# Altium project NNLightSwitcher.PrjPcb (part 1 of 5)
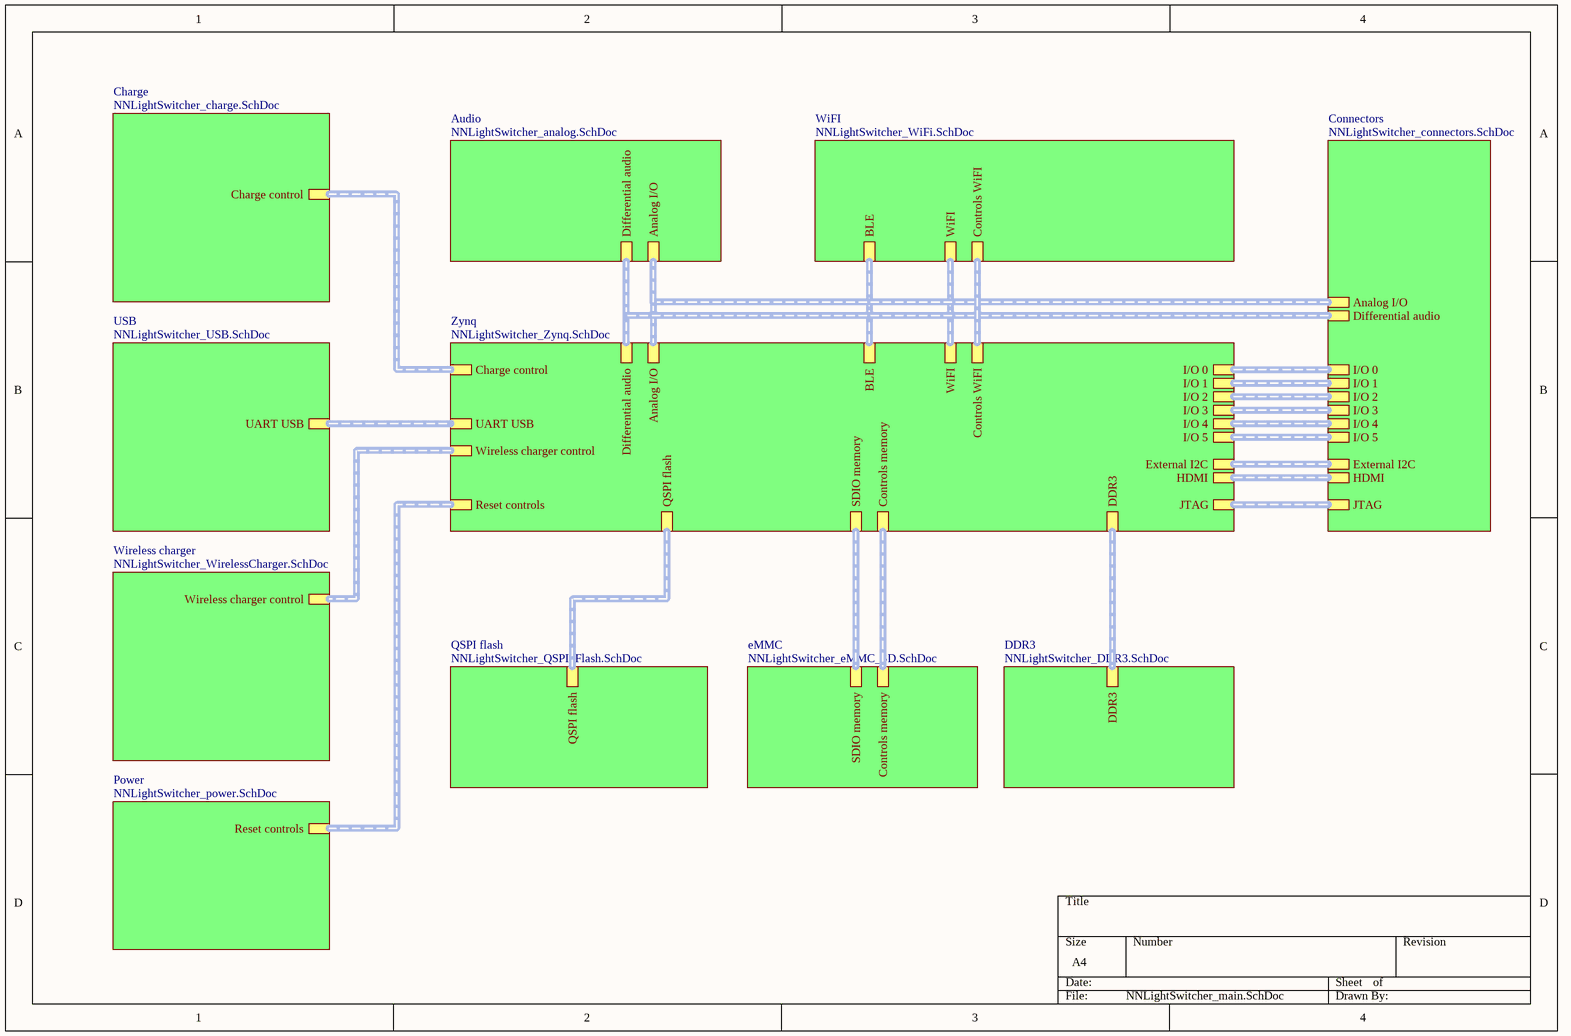
[diagram p0: NNLightSwitcher_main.SchDoc]
12 sheets, 369 parts. Net scope: hierarchical (ports join the sheet entries above them; power ports are global).
Board file: NNLightSwitcher.PcbDoc
Sheets:
  NNLightSwitcher_main.SchDoc
    Zynq = NNLightSwitcher_Zynq.SchDoc
    DDR3 = NNLightSwitcher_DDR3.SchDoc
    eMMC = NNLightSwitcher_eMMC_SD.SchDoc
    QSPI flash = NNLightSwitcher_QSPI_Flash.SchDoc
    WiFI = NNLightSwitcher_WiFi.SchDoc
    USB = NNLightSwitcher_USB.SchDoc
    Power = NNLightSwitcher_power.SchDoc
    Audio = NNLightSwitcher_analog.SchDoc
    Connectors = NNLightSwitcher_connectors.SchDoc
    Wireless charger = NNLightSwitcher_WirelessCharger.SchDoc
    Charge = NNLightSwitcher_charge.SchDoc

## Sheet NNLightSwitcher_main.SchDoc
size A4

### Sub-sheets
Audio = NNLightSwitcher_analog.SchDoc: Analog I/O (harness GPIO), Differential audio (harness Differential Audio)
Charge = NNLightSwitcher_charge.SchDoc: Charge control (harness I2C)
Connectors = NNLightSwitcher_connectors.SchDoc: I/O 0 (harness GPIO), HDMI (harness HDMI), JTAG (harness JTAG), I/O 1 (harness GPIO), I/O 2 (harness GPIO), I/O 3 (harness GPIO), I/O 4 (harness GPIO), I/O 5 (harness GPIO), External I2C (harness I2C), Analog I/O (harness GPIO), Differential audio (harness Differential Audio)
DDR3 = NNLightSwitcher_DDR3.SchDoc: DDR3 (harness DDR3)
eMMC = NNLightSwitcher_eMMC_SD.SchDoc: SDIO memory (harness SDIO), Controls memory (harness Controls flash)
Power = NNLightSwitcher_power.SchDoc: Reset controls (harness Controls reset)
QSPI flash = NNLightSwitcher_QSPI_Flash.SchDoc: QSPI flash (harness QuadSPI)
USB = NNLightSwitcher_USB.SchDoc: UART USB (harness UART)
WiFI = NNLightSwitcher_WiFi.SchDoc: BLE (harness UART), WiFI (harness SDIO), Controls WiFI (harness Controls WiFI)
Wireless charger = NNLightSwitcher_WirelessCharger.SchDoc: Wireless charger control (harness GPIO)
Zynq = NNLightSwitcher_Zynq.SchDoc: Charge control (harness I2C), UART USB (harness UART), BLE (harness UART), WiFI (harness SDIO), DDR3 (harness DDR3), SDIO memory (harness SDIO), QSPI flash (harness QuadSPI), Reset controls (harness Controls reset), I/O 0 (harness GPIO), JTAG (harness JTAG), I/O 2 (harness GPIO), I/O 3 (harness GPIO), I/O 4 (harness GPIO), I/O 1 (harness GPIO), HDMI (harness HDMI), I/O 5 (harness GPIO), Wireless charger control (harness GPIO), External I2C (harness I2C), Analog I/O (harness GPIO), Controls memory (harness Controls flash), Differential audio (harness Differential Audio), Controls WiFI (harness Controls WiFI)

### Buses and harness runs
harness sheet Audio/Analog I/O = sheet Connectors/Analog I/O = sheet Zynq/Analog I/O
harness sheet Audio/Differential audio = sheet Connectors/Differential audio = sheet Zynq/Differential audio
harness sheet Charge/Charge control = sheet Zynq/Charge control
harness sheet Connectors/External I2C = sheet Zynq/External I2C
harness sheet Connectors/HDMI = sheet Zynq/HDMI
harness sheet Connectors/I/O 0 = sheet Zynq/I/O 0
harness sheet Connectors/I/O 1 = sheet Zynq/I/O 1
harness sheet Connectors/I/O 2 = sheet Zynq/I/O 2
harness sheet Connectors/I/O 3 = sheet Zynq/I/O 3
harness sheet Connectors/I/O 4 = sheet Zynq/I/O 4
harness sheet Connectors/I/O 5 = sheet Zynq/I/O 5
harness sheet Connectors/JTAG = sheet Zynq/JTAG
harness sheet DDR3/DDR3 = sheet Zynq/DDR3
harness sheet eMMC/Controls memory = sheet Zynq/Controls memory
harness sheet eMMC/SDIO memory = sheet Zynq/SDIO memory
harness sheet Power/Reset controls = sheet Zynq/Reset controls
harness sheet QSPI flash/QSPI flash = sheet Zynq/QSPI flash
harness sheet USB/UART USB = sheet Zynq/UART USB
harness sheet WiFI/BLE = sheet Zynq/BLE
harness sheet WiFI/Controls WiFI = sheet Zynq/Controls WiFI
harness sheet WiFI/WiFI = sheet Zynq/WiFI
harness sheet Wireless charger/Wireless charger control = sheet Zynq/Wireless charger control

## Sheet NNLightSwitcher_Zynq.SchDoc
size A2
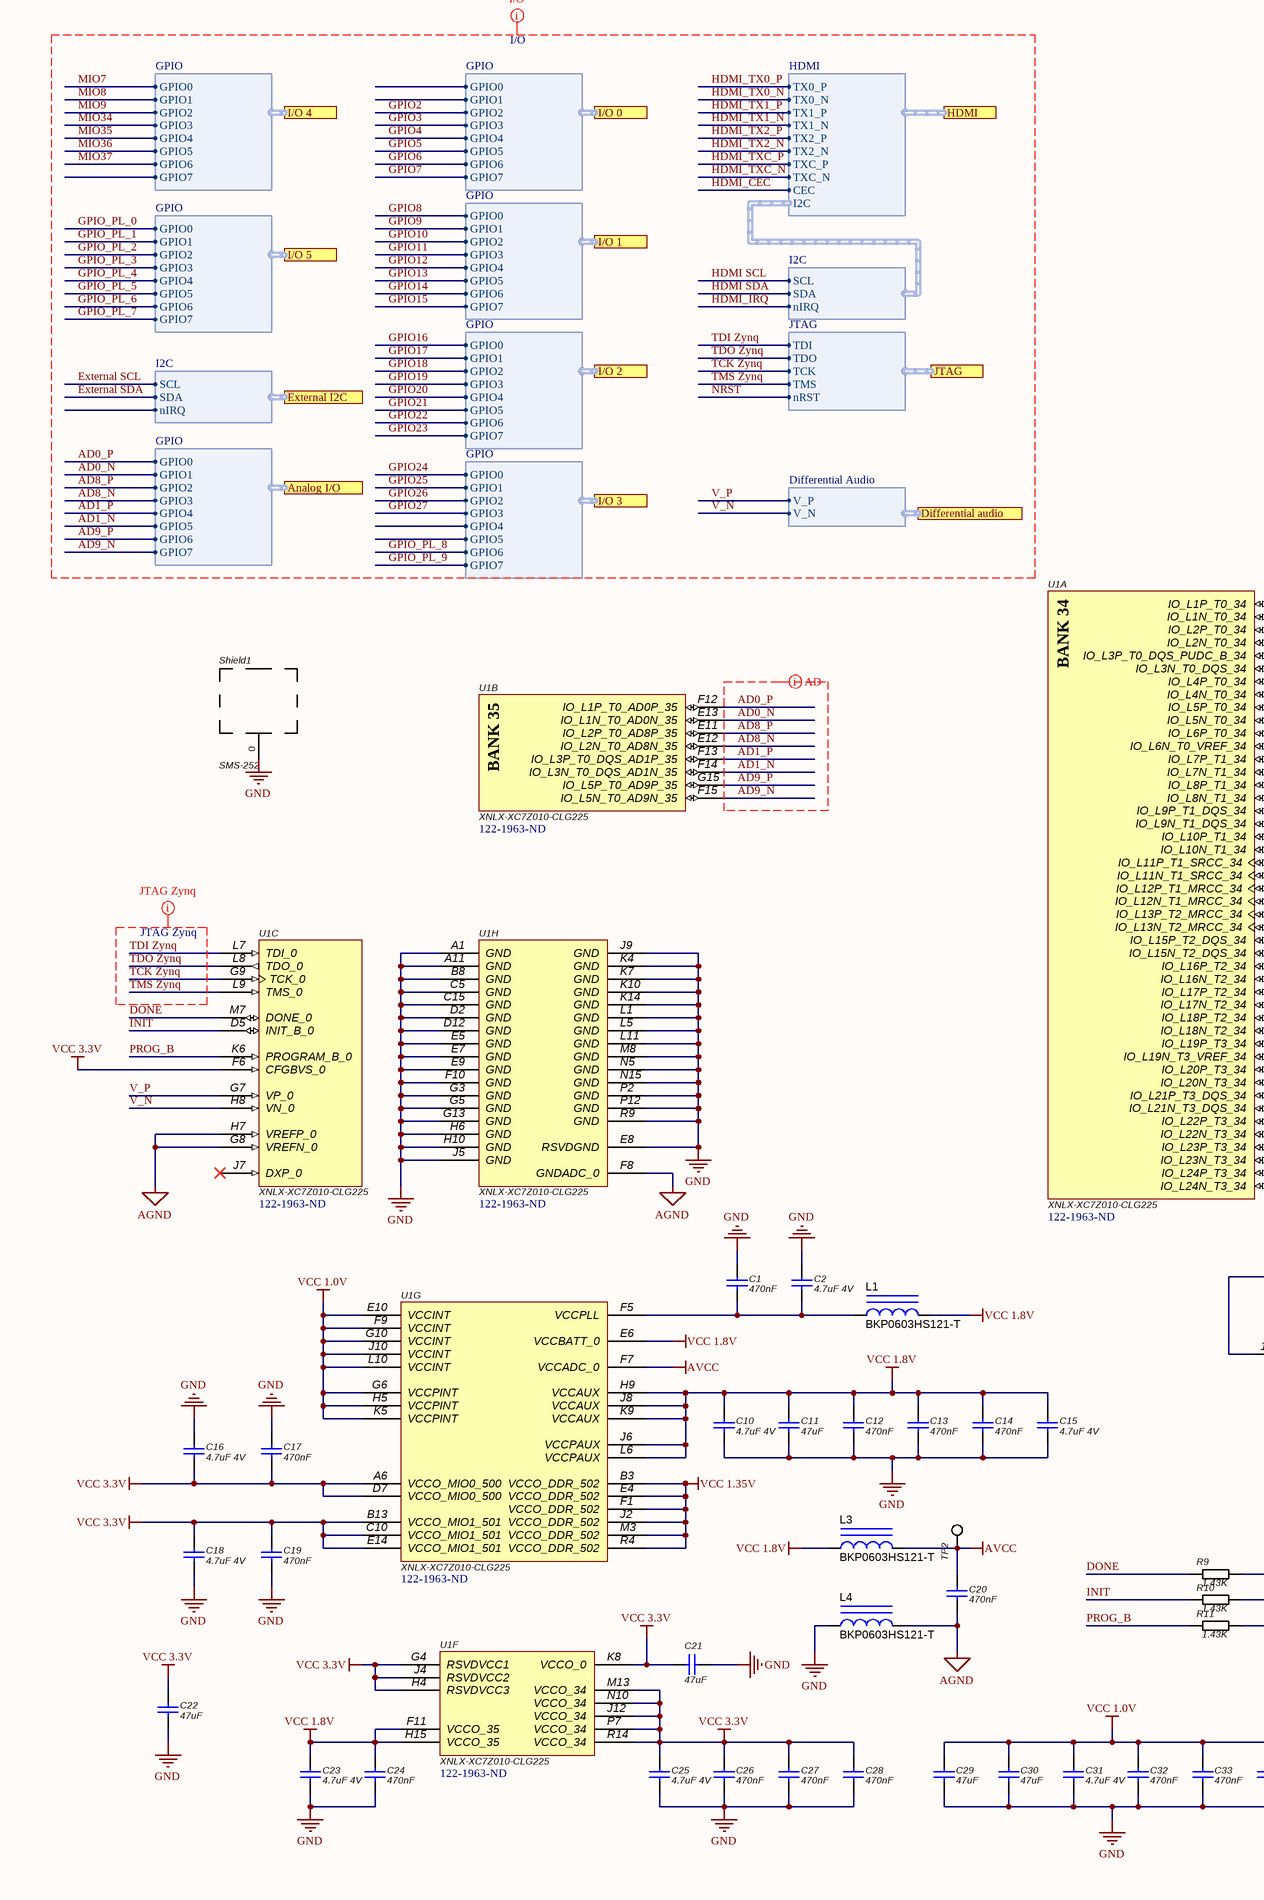
[diagram p1: NNLightSwitcher_Zynq.SchDoc, left]
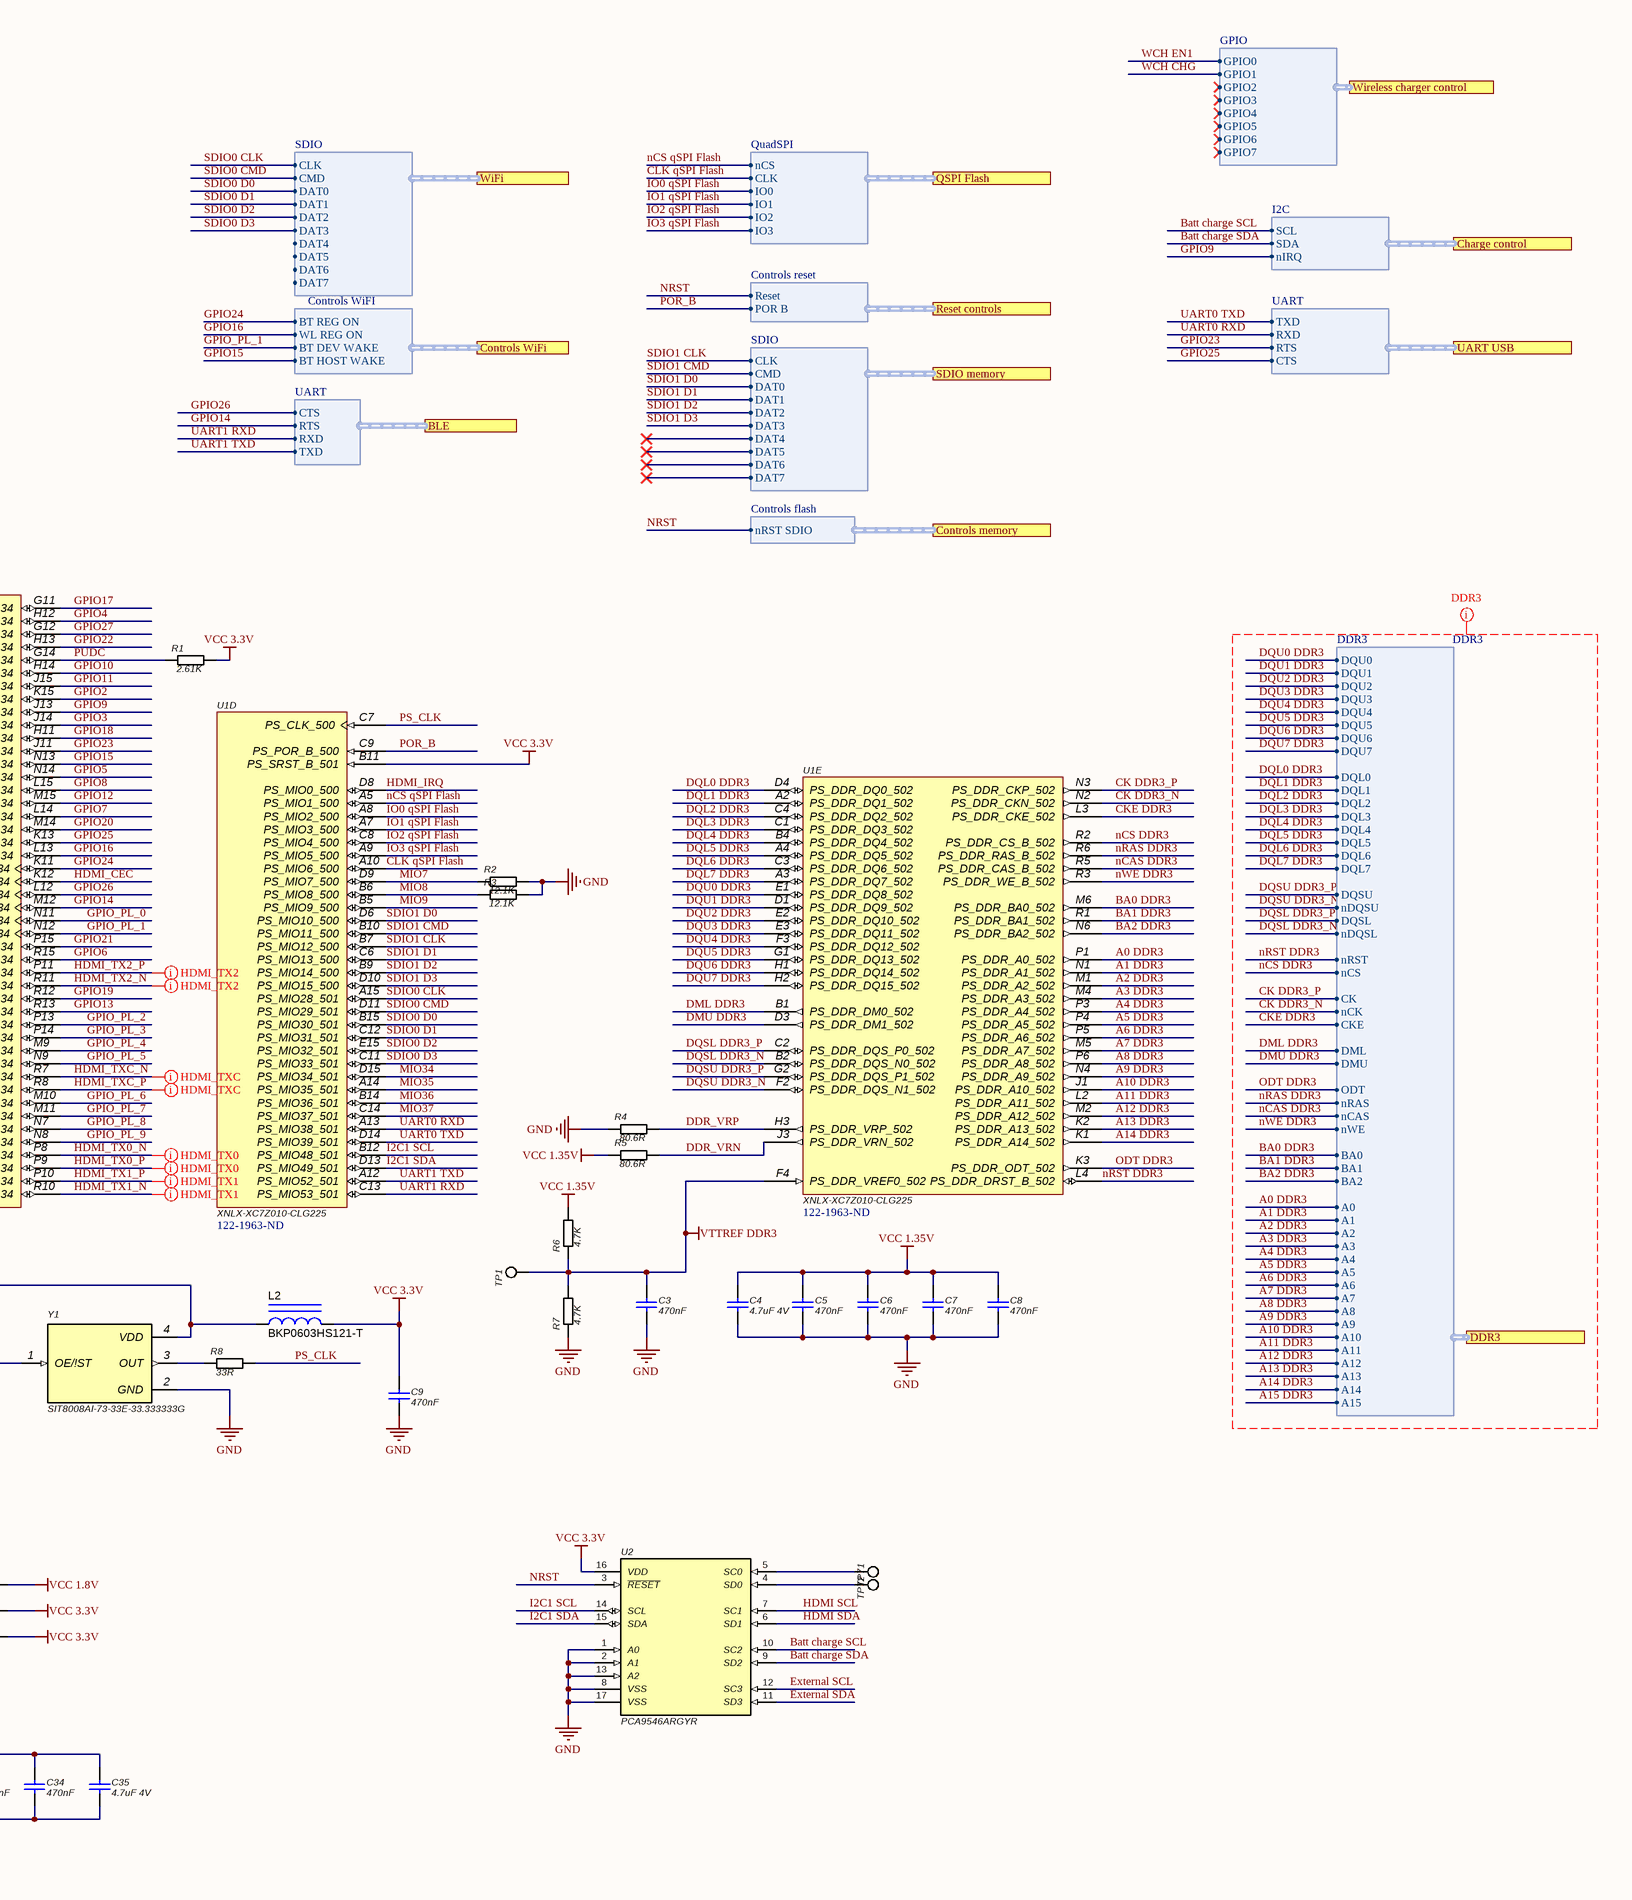
[diagram p2: NNLightSwitcher_Zynq.SchDoc, right]

### Parts
C1  470nF  [0402]
C2  4.7uF 4V  [0402]
C3  470nF  [0402]
C4  4.7uF 4V  [0402]
C5  470nF  [0402]
C6  470nF  [0402]
C7  470nF  [0402]
C8  470nF  [0402]
C9  470nF  [0402]
C10  4.7uF 4V  [0402]
C11  47uF  [Res_0805]
C12  470nF  [0402]
C13  470nF  [0402]
C14  470nF  [0402]
C15  4.7uF 4V  [0402]
C16  4.7uF 4V  [0402]
C17  470nF  [0402]
C18  4.7uF 4V  [0402]
C19  470nF  [0402]
C20  470nF  [0402]
C21  47uF  [Res_0805]
C22  47uF  [Res_0805]
C23  4.7uF 4V  [0402]
C24  470nF  [0402]
C25  4.7uF 4V  [0402]
C26  470nF  [0402]
C27  470nF  [0402]
C28  470nF  [0402]
C29  47uF  [Res_0805]
C30  47uF  [Res_0805]
C31  4.7uF 4V  [0402]
C32  470nF  [0402]
C33  470nF  [0402]
C34  470nF  [0402]
C35  4.7uF 4V  [0402]
L1  BKP0603HS121-T  [*0603]
L2  BKP0603HS121-T  [*0603]
L3  BKP0603HS121-T  [*0603]
L4  BKP0603HS121-T  [*0603]
R1  2.61K  [0402]
R2  12.1K  [0402]
R3  12.1K  [0402]
R4  80.6R  [0402]
R5  80.6R  [0402]
R6  4.7K  [0402]
R7  4.7K  [0402]
R8  33R  [0402]
R9  1.43K  [0402]
R10  1.43K  [0402]
R11  1.43K  [0402]
Shield1  SMS-252  [shield]
TP1  Test point  [Testpoint_Keystone_Miniature]  (value not drawn)
TP2  Test point  [Testpoint_Keystone_Miniature]  (value not drawn)
TP71  Test point  [Testpoint_Keystone_Miniature]  (value not drawn)
TP72  Test point  [Testpoint_Keystone_Miniature]  (value not drawn)
U1  XNLX-XC7Z010-CLG225  Supplier Part Number 1: 122-1963-ND  [CLG225]  (parts A,B,C,D,E,F,G,H of 8)
U2  PCA9546ARGYR  [*QFN50P400X350X100-17N(205X255)]
Y1  SIT8008AI-73-33E-33.333333G  [*OSC_SIT8008AI-73-33E-33.333333G]

### Ports
Analog I/O (harness GPIO), BLE (harness UART), Charge control (harness I2C), Controls memory (harness Controls flash), Controls WiFi (harness Controls WiFI), DDR3 (harness DDR3), Differential audio (harness Differential Audio), External I2C (harness I2C), HDMI (harness HDMI), I/O 0 (harness GPIO), I/O 1 (harness GPIO), I/O 2 (harness GPIO), I/O 3 (harness GPIO), I/O 4 (harness GPIO), I/O 5 (harness GPIO), JTAG (harness JTAG), QSPI Flash (harness QuadSPI), Reset controls (harness Controls reset), SDIO memory (harness SDIO), UART USB (harness UART), WiFi (harness SDIO), Wireless charger control (harness GPIO)

### Harnesses
UART: RXD, RTS, TXD, CTS
QuadSPI: IO1, IO0, IO3, IO2, CLK, nCS
UART: CTS, RTS, RXD, TXD
SDIO: CLK, CMD, DAT1, DAT0, DAT3, DAT2, DAT5, DAT4, DAT7, DAT6
DDR3: A12, A11, A14, A13, A10, A9, A15, A8, A7, A6, A5, A4, A3, A2, A1, A0, BA2, BA1, BA0, nWE, nCAS, nRAS, ODT, DMU, DML, CKE, nCK, CK, nCS, nRST, nDQSL, nDQSU, DQSL, DQSU, DQL7, DQL6, DQL5, DQL4, DQL3, DQL2, DQL1, DQL0, DQU7, DQU6, DQU5, DQU4, DQU3, DQU2, DQU1, DQU0
Controls flash: nRST SDIO
GPIO: GPIO7, GPIO6, GPIO5, GPIO4, GPIO3, GPIO2, GPIO1, GPIO0
HDMI: TXC_N, TXC_P, TX2_N, TX2_P, TX1_N, TX1_P, TX0_N, TX0_P, CEC, I2C
I2C: SDA, SCL, nIRQ
JTAG: TMS, TCK, TDO, TDI, nRST
Controls WiFI: BT DEV WAKE, WL REG ON, BT REG ON, BT HOST WAKE
Controls reset: POR B, Reset
Differential Audio: V_N, V_P

### Nets
AGND: C20.2 L4.2 U1.F8(GNDADC_0) U1.G8(VREFN_0) U1.H7(VREFP_0)
AVCC: C20.1 L3.2 TP2.1 U1.F7(VCCADC_0)
GND: C1.1 C2.1 C3.2 C4.2 C5.2 C6.2 C7.2 C8.2 C9.2 C10.2 C11.2 C12.2 C13.2 C14.2 C15.2 C16.1 C17.1 C18.2 C19.2 C21.1 C22.2 C23.2 C24.2 C25.2 C26.2 C27.2 C28.2 C29.2 C30.2 C31.2 C32.2 C33.2 C34.2 C35.2 L4.1 R2.2 R3.2 R4.1 R7.1 Shield1.0(Feed) U1.A1(GND) U1.A11(GND) U1.B8(GND) U1.C5(GND) U1.C15(GND) U1.D2(GND) U1.D12(GND) U1.E5(GND) U1.E7(GND) U1.E8(RSVDGND) U1.E9(GND) U1.F10(GND) U1.G3(GND) U1.G5(GND) U1.G13(GND) U1.H6(GND) U1.H10(GND) U1.J5(GND) U1.J9(GND) U1.K4(GND) U1.K7(GND) U1.K10(GND) U1.K14(GND) U1.L1(GND) U1.L5(GND) U1.L11(GND) U1.M8(GND) U1.N5(GND) U1.N15(GND) U1.P2(GND) U1.P12(GND) U1.R9(GND) U2.1(A0) U2.2(A1) U2.8(VSS) U2.13(A2) U2.17(VSS) Y1.2(GND)
VCC 1.0V: C29.1 C30.1 C31.1 C32.1 C33.1 C34.1 C35.1 U1.E10(VCCINT) U1.F9(VCCINT) U1.G6(VCCPINT) U1.G10(VCCINT) U1.H5(VCCPINT) U1.J10(VCCINT) U1.K5(VCCPINT) U1.L10(VCCINT)
VCC 1.8V: C10.1 C11.1 C12.1 C13.1 C14.1 C15.1 C23.1 C24.1 L1.2 L3.1 R9.2 U1.E6(VCCBATT_0) U1.F11(VCCO_35) U1.H9(VCCAUX) U1.H15(VCCO_35) U1.J6(VCCPAUX) U1.J8(VCCAUX) U1.K9(VCCAUX) U1.L6(VCCPAUX)
VCC 1.35V: C4.1 C5.1 C6.1 C7.1 C8.1 R5.1 R6.2 U1.B3(VCCO_DDR_502) U1.E4(VCCO_DDR_502) U1.F1(VCCO_DDR_502) U1.J2(VCCO_DDR_502) U1.M3(VCCO_DDR_502) U1.R4(VCCO_DDR_502)
VCC 3.3V: C9.1 C16.2 C17.2 C18.1 C19.1 C21.2 C22.1 C25.1 C26.1 C27.1 C28.1 L2.2 R1.2 R10.2 R11.2 U1.A6(VCCO_MIO0_500) U1.B11(PS_SRST_B_501) U1.B13(VCCO_MIO1_501) U1.C10(VCCO_MIO1_501) U1.D7(VCCO_MIO0_500) U1.E14(VCCO_MIO1_501) U1.F6(CFGBVS_0) U1.G4(RSVDVCC1) U1.H4(RSVDVCC3) U1.J4(RSVDVCC2) U1.J12(VCCO_34) U1.K8(VCCO_0) U1.M13(VCCO_34) U1.N10(VCCO_34) U1.P7(VCCO_34) U1.R14(VCCO_34) U2.16(VDD)
VTTREF DDR3: C3.1 R6.1 R7.2 TP1.1 U1.F4(PS_DDR_VREF0_502)
A0 DDR3: U1.P1(PS_DDR_A0_502) ; port DDR3.A0
A1 DDR3: U1.N1(PS_DDR_A1_502) ; port DDR3.A1
A2 DDR3: U1.M1(PS_DDR_A2_502) ; port DDR3.A2
A3 DDR3: U1.M4(PS_DDR_A3_502) ; port DDR3.A3
A4 DDR3: U1.P3(PS_DDR_A4_502) ; port DDR3.A4
A5 DDR3: U1.P4(PS_DDR_A5_502) ; port DDR3.A5
A6 DDR3: U1.P5(PS_DDR_A6_502) ; port DDR3.A6
A7 DDR3: U1.M5(PS_DDR_A7_502) ; port DDR3.A7
A8 DDR3: U1.P6(PS_DDR_A8_502) ; port DDR3.A8
A9 DDR3: U1.N4(PS_DDR_A9_502) ; port DDR3.A9
A10 DDR3: U1.J1(PS_DDR_A10_502) ; port DDR3.A10
A11 DDR3: U1.L2(PS_DDR_A11_502) ; port DDR3.A11
A12 DDR3: U1.M2(PS_DDR_A12_502) ; port DDR3.A12
A13 DDR3: U1.K2(PS_DDR_A13_502) ; port DDR3.A13
A14 DDR3: U1.K1(PS_DDR_A14_502) ; port DDR3.A14
AD0_N: U1.E13(IO_L1N_T0_AD0N_35) ; port Analog I/O.GPIO1
AD0_P: U1.F12(IO_L1P_T0_AD0P_35) ; port Analog I/O.GPIO0
AD1_N: U1.F14(IO_L3N_T0_DQS_AD1N_35) ; port Analog I/O.GPIO5
AD1_P: U1.F13(IO_L3P_T0_DQS_AD1P_35) ; port Analog I/O.GPIO4
AD8_N: U1.E12(IO_L2N_T0_AD8N_35) ; port Analog I/O.GPIO3
AD8_P: U1.E11(IO_L2P_T0_AD8P_35) ; port Analog I/O.GPIO2
AD9_N: U1.F15(IO_L5N_T0_AD9N_35) ; port Analog I/O.GPIO7
AD9_P: U1.G15(IO_L5P_T0_AD9P_35) ; port Analog I/O.GPIO6
BA0 DDR3: U1.M6(PS_DDR_BA0_502) ; port DDR3.BA0
BA1 DDR3: U1.R1(PS_DDR_BA1_502) ; port DDR3.BA1
BA2 DDR3: U1.N6(PS_DDR_BA2_502) ; port DDR3.BA2
Batt charge SCL: U2.10(SC2) ; port Charge control.SCL
Batt charge SDA: U2.9(SD2) ; port Charge control.SDA
CK DDR3_N: U1.N2(PS_DDR_CKN_502) ; port DDR3.nCK
CK DDR3_P: U1.N3(PS_DDR_CKP_502) ; port DDR3.CK
CKE DDR3: U1.L3(PS_DDR_CKE_502) ; port DDR3.CKE
CLK qSPI Flash: U1.A10(PS_MIO6_500) ; port QSPI Flash.CLK
DDR_VRN: R5.2 U1.J3(PS_DDR_VRN_502)
DDR_VRP: R4.2 U1.H3(PS_DDR_VRP_502)
DML DDR3: U1.B1(PS_DDR_DM0_502) ; port DDR3.DML
DMU DDR3: U1.D3(PS_DDR_DM1_502) ; port DDR3.DMU
DONE: R9.1 U1.M7(DONE_0)
DQL0 DDR3: U1.D4(PS_DDR_DQ0_502) ; port DDR3.DQL0
DQL1 DDR3: U1.A2(PS_DDR_DQ1_502) ; port DDR3.DQL1
DQL2 DDR3: U1.C4(PS_DDR_DQ2_502) ; port DDR3.DQL2
DQL3 DDR3: U1.C1(PS_DDR_DQ3_502) ; port DDR3.DQL3
DQL4 DDR3: U1.B4(PS_DDR_DQ4_502) ; port DDR3.DQL4
DQL5 DDR3: U1.A4(PS_DDR_DQ5_502) ; port DDR3.DQL5
DQL6 DDR3: U1.C3(PS_DDR_DQ6_502) ; port DDR3.DQL6
DQL7 DDR3: U1.A3(PS_DDR_DQ7_502) ; port DDR3.DQL7
DQSL DDR3_N: U1.B2(PS_DDR_DQS_N0_502) ; port DDR3.nDQSL
DQSL DDR3_P: U1.C2(PS_DDR_DQS_P0_502) ; port DDR3.DQSL
DQSU DDR3_N: U1.F2(PS_DDR_DQS_N1_502) ; port DDR3.nDQSU
DQSU DDR3_P: U1.G2(PS_DDR_DQS_P1_502) ; port DDR3.DQSU
DQU0 DDR3: U1.E1(PS_DDR_DQ8_502) ; port DDR3.DQU0
DQU1 DDR3: U1.D1(PS_DDR_DQ9_502) ; port DDR3.DQU1
DQU2 DDR3: U1.E2(PS_DDR_DQ10_502) ; port DDR3.DQU2
DQU3 DDR3: U1.E3(PS_DDR_DQ11_502) ; port DDR3.DQU3
DQU4 DDR3: U1.F3(PS_DDR_DQ12_502) ; port DDR3.DQU4
DQU5 DDR3: U1.G1(PS_DDR_DQ13_502) ; port DDR3.DQU5
DQU6 DDR3: U1.H1(PS_DDR_DQ14_502) ; port DDR3.DQU6
DQU7 DDR3: U1.H2(PS_DDR_DQ15_502) ; port DDR3.DQU7
External SCL: U2.12(SC3) ; port External I2C.SCL
External SDA: U2.11(SD3) ; port External I2C.SDA
GPIO2: U1.K15(IO_L4N_T0_34) ; port I/O 0.GPIO2
GPIO3: U1.J14(IO_L5N_T0_34) ; port I/O 0.GPIO3
GPIO4: U1.H12(IO_L1N_T0_34) ; port I/O 0.GPIO4
GPIO5: U1.N14(IO_L7N_T1_34) ; port I/O 0.GPIO5
GPIO6: U1.R15(IO_L15N_T2_DQS_34) ; port I/O 0.GPIO6
GPIO7: U1.L14(IO_L9P_T1_DQS_34) ; port I/O 0.GPIO7
GPIO8: U1.L15(IO_L8P_T1_34) ; port I/O 1.GPIO0
GPIO9: U1.J13(IO_L5P_T0_34) ; port I/O 1.GPIO1, port Charge control.nIRQ
GPIO10: U1.H14(IO_L3N_T0_DQS_34) ; port I/O 1.GPIO2
GPIO11: U1.J15(IO_L4P_T0_34) ; port I/O 1.GPIO3
GPIO12: U1.M15(IO_L8N_T1_34) ; port I/O 1.GPIO4
GPIO13: U1.R13(IO_L17N_T2_34) ; port I/O 1.GPIO5
GPIO14: U1.M12(IO_L12N_T1_MRCC_34) ; port BLE.RTS, port I/O 1.GPIO6
GPIO15: U1.N13(IO_L7P_T1_34) ; port I/O 1.GPIO7, port Controls WiFi.BT HOST WAKE  [project net BT_HOST_WAKE]
GPIO16: U1.L13(IO_L10N_T1_34) ; port I/O 2.GPIO0, port Controls WiFi.WL REG ON
GPIO17: U1.G11(IO_L1P_T0_34) ; port I/O 2.GPIO1
GPIO18: U1.H11(IO_L6P_T0_34) ; port I/O 2.GPIO2
GPIO19: U1.R12(IO_L17P_T2_34) ; port I/O 2.GPIO3
GPIO20: U1.M14(IO_L9N_T1_DQS_34) ; port I/O 2.GPIO4
GPIO21: U1.P15(IO_L15P_T2_DQS_34) ; port I/O 2.GPIO5
GPIO22: U1.H13(IO_L2N_T0_34) ; port I/O 2.GPIO6
GPIO23: U1.J11(IO_L6N_T0_VREF_34) ; port UART USB.RTS, port I/O 2.GPIO7
GPIO24: U1.K11(IO_L11P_T1_SRCC_34) ; port I/O 3.GPIO0, port Controls WiFi.BT REG ON  [project net BT_REG_ON]
GPIO25: U1.K13(IO_L10P_T1_34) ; port UART USB.CTS, port I/O 3.GPIO1
GPIO26: U1.L12(IO_L12P_T1_MRCC_34) ; port BLE.CTS, port I/O 3.GPIO2
GPIO27: U1.G12(IO_L2P_T0_34) ; port I/O 3.GPIO3
GPIO_PL_0: U1.N11(IO_L13P_T2_MRCC_34) ; port I/O 5.GPIO0
GPIO_PL_1: U1.N12(IO_L13N_T2_MRCC_34) ; port I/O 5.GPIO1, port Controls WiFi.BT DEV WAKE  [project net BT_DEV_WAKE]
GPIO_PL_2: U1.P13(IO_L18P_T2_34) ; port I/O 5.GPIO2
GPIO_PL_3: U1.P14(IO_L18N_T2_34) ; port I/O 5.GPIO3
GPIO_PL_4: U1.M9(IO_L19P_T3_34) ; port I/O 5.GPIO4
GPIO_PL_5: U1.N9(IO_L19N_T3_VREF_34) ; port I/O 5.GPIO5
GPIO_PL_6: U1.M10(IO_L21P_T3_DQS_34) ; port I/O 5.GPIO6
GPIO_PL_7: U1.M11(IO_L21N_T3_DQS_34) ; port I/O 5.GPIO7
GPIO_PL_8: U1.N7(IO_L22P_T3_34) ; port I/O 3.GPIO6
GPIO_PL_9: U1.N8(IO_L22N_T3_34) ; port I/O 3.GPIO7
HDMI SCL: U2.7(SC1) ; harness I2C.SCL
HDMI SDA: U2.6(SD1) ; harness I2C.SDA
HDMI_CEC: U1.K12(IO_L11N_T1_SRCC_34) ; port HDMI.CEC
HDMI_IRQ: U1.D8(PS_MIO0_500) ; harness I2C.nIRQ
HDMI_TX0_N: U1.P8(IO_L23P_T3_34) ; port HDMI.TX0_N
HDMI_TX0_P: U1.P9(IO_L23N_T3_34) ; port HDMI.TX0_P
HDMI_TX1_N: U1.R10(IO_L24N_T3_34) ; port HDMI.TX1_N
HDMI_TX1_P: U1.P10(IO_L24P_T3_34) ; port HDMI.TX1_P
HDMI_TX2_N: U1.R11(IO_L16N_T2_34) ; port HDMI.TX2_N
HDMI_TX2_P: U1.P11(IO_L16P_T2_34) ; port HDMI.TX2_P
HDMI_TXC_N: U1.R7(IO_L20P_T3_34) ; port HDMI.TXC_N
HDMI_TXC_P: U1.R8(IO_L20N_T3_34) ; port HDMI.TXC_P
I2C1 SCL: U1.B12(PS_MIO48_501) U2.14(SCL)
I2C1 SDA: U1.D13(PS_MIO49_501) U2.15(SDA)
INIT: R10.1 U1.D5(INIT_B_0)
IO0 qSPI Flash: U1.A8(PS_MIO2_500) ; port QSPI Flash.IO0
IO1 qSPI Flash: U1.A7(PS_MIO3_500) ; port QSPI Flash.IO1
IO2 qSPI Flash: U1.C8(PS_MIO4_500) ; port QSPI Flash.IO2
IO3 qSPI Flash: U1.A9(PS_MIO5_500) ; port QSPI Flash.IO3
MIO7: R2.1 U1.D9(PS_MIO7_500) ; port I/O 4.GPIO0
MIO8: R3.1 U1.B6(PS_MIO8_500) ; port I/O 4.GPIO1
MIO9: U1.B5(PS_MIO9_500) ; port I/O 4.GPIO2
MIO34: U1.D15(PS_MIO34_501) ; port I/O 4.GPIO3
MIO35: U1.A14(PS_MIO35_501) ; port I/O 4.GPIO4
MIO36: U1.B14(PS_MIO36_501) ; port I/O 4.GPIO5
MIO37: U1.C14(PS_MIO37_501) ; port I/O 4.GPIO6
nCAS DDR3: U1.R5(PS_DDR_CAS_B_502) ; port DDR3.nCAS
nCS DDR3: U1.R2(PS_DDR_CS_B_502) ; port DDR3.nCS
nCS qSPI Flash: U1.A5(PS_MIO1_500) ; port QSPI Flash.nCS
nRAS DDR3: U1.R6(PS_DDR_RAS_B_502) ; port DDR3.nRAS
NRST: U2.3(~{RESET}) ; port Controls memory.nRST SDIO, port JTAG.nRST, port Reset controls.Reset  [project net nMRST]
nRST DDR3: U1.L4(PS_DDR_DRST_B_502) ; port DDR3.nRST
nWE DDR3: U1.R3(PS_DDR_WE_B_502) ; port DDR3.nWE
ODT DDR3: U1.K3(PS_DDR_ODT_502) ; port DDR3.ODT
POR_B: U1.C9(PS_POR_B_500) ; port Reset controls.POR B
PROG_B: R11.1 U1.K6(PROGRAM_B_0)
PS_CLK: R8.2 U1.C7(PS_CLK_500)
PUDC: R1.1 U1.G14(IO_L3P_T0_DQS_PUDC_B_34)
SDIO0 CLK: U1.A15(PS_MIO28_501) ; port WiFi.CLK  [project net SDIO CLK WiFi]
SDIO0 CMD: U1.D11(PS_MIO29_501) ; port WiFi.CMD  [project net SDIO CMD WiFi]
SDIO0 D0: U1.B15(PS_MIO30_501) ; port WiFi.DAT0  [project net SDIO DAT0 WiFi]
SDIO0 D1: U1.C12(PS_MIO31_501) ; port WiFi.DAT1  [project net SDIO DAT1 WiFi]
SDIO0 D2: U1.E15(PS_MIO32_501) ; port WiFi.DAT2  [project net SDIO DAT2 WiFi]
SDIO0 D3: U1.C11(PS_MIO33_501) ; port WiFi.DAT3  [project net SDIO DAT3 WiFi]
SDIO1 CLK: U1.B7(PS_MIO12_500) ; port SDIO memory.CLK  [project net CLK SDIO Zync]
SDIO1 CMD: U1.B10(PS_MIO11_500) ; port SDIO memory.CMD  [project net CMD SDIO Zync]
SDIO1 D0: U1.D6(PS_MIO10_500) ; port SDIO memory.DAT0  [project net DAT0 SDIO Zync]
SDIO1 D1: U1.C6(PS_MIO13_500) ; port SDIO memory.DAT1  [project net DAT1 SDIO Zync]
SDIO1 D2: U1.B9(PS_MIO14_500) ; port SDIO memory.DAT2  [project net DAT2 SDIO Zync]
SDIO1 D3: U1.D10(PS_MIO15_500) ; port SDIO memory.DAT3  [project net DAT3 SDIO Zync]
TCK Zynq: U1.G9(TCK_0) ; port JTAG.TCK
TDI Zynq: U1.L7(TDI_0) ; port JTAG.TDI
TDO Zynq: U1.L8(TDO_0) ; port JTAG.TDO
TMS Zynq: U1.L9(TMS_0) ; port JTAG.TMS
UART0 RXD: U1.A13(PS_MIO38_501) ; port UART USB.RXD  [project net UART RXD USB]
UART0 TXD: U1.D14(PS_MIO39_501) ; port UART USB.TXD  [project net UART TXD USB]
UART1 RXD: U1.C13(PS_MIO53_501) ; port BLE.RXD  [project net UART RXD BLE]
UART1 TXD: U1.A12(PS_MIO52_501) ; port BLE.TXD  [project net UART TXD BLE]
V_N: U1.H8(VN_0) ; port Differential audio.V_N  [project net Audio_N]
V_P: U1.G7(VP_0) ; port Differential audio.V_P  [project net Audio_P]
NetC1_2: C1.2 C2.2 L1.1 U1.F5(VCCPLL)
NetL2_1: L2.1 Y1.1(OE/!ST) Y1.4(VDD)
NetR8_1: R8.1 Y1.3(OUT)
NetTP71_1: TP71.1 U2.5(SC0)
NetTP72_1: TP72.1 U2.4(SD0)

Not connected (* = marked no-connect by the designer): U1 J7(DXP_0)*

### Layout directives
differential pair: AD0_N, AD0_P, AD1_N, AD1_P, AD8_N, AD8_P, AD9_N, AD9_P, HDMI_TX0_N, HDMI_TX0_P, HDMI_TX1_N, HDMI_TX1_P, HDMI_TX2_N, HDMI_TX2_P, HDMI_TXC_N, HDMI_TXC_P
net class I/O: AD0_N, AD0_P, AD1_N, AD1_P, AD8_N, AD8_P, AD9_N, AD9_P, External SCL, External SDA, GPIO2, GPIO3, GPIO4, GPIO5, GPIO6, GPIO7, GPIO8, GPIO9, GPIO10, GPIO11, GPIO12, GPIO13, GPIO14, GPIO15, GPIO16, GPIO17, GPIO18, GPIO19, GPIO20, GPIO21, GPIO22, GPIO23, GPIO24, GPIO25, GPIO26, GPIO27, GPIO_PL_0, GPIO_PL_1, GPIO_PL_2, GPIO_PL_3, GPIO_PL_4, GPIO_PL_5, GPIO_PL_6, GPIO_PL_7, GPIO_PL_8, GPIO_PL_9, HDMI SCL, HDMI SDA, HDMI_CEC, HDMI_IRQ, HDMI_TX0_N, HDMI_TX0_P, HDMI_TX1_N, HDMI_TX1_P, HDMI_TX2_N, HDMI_TX2_P, HDMI_TXC_N, HDMI_TXC_P, MIO7, MIO8, MIO9, MIO34, MIO35, MIO36, MIO37, NRST, TCK Zynq, TDI Zynq, TDO Zynq, TMS Zynq, V_N, V_P
net class DDR3: A0 DDR3, A1 DDR3, A2 DDR3, A3 DDR3, A4 DDR3, A5 DDR3, A6 DDR3, A7 DDR3, A8 DDR3, A9 DDR3, A10 DDR3, A11 DDR3, A12 DDR3, A13 DDR3, A14 DDR3, A15 DDR3, BA0 DDR3, BA1 DDR3, BA2 DDR3, CK DDR3_N, CK DDR3_P, CKE DDR3, DML DDR3, DMU DDR3, DQL0 DDR3, DQL1 DDR3, DQL2 DDR3, DQL3 DDR3, DQL4 DDR3, DQL5 DDR3, DQL6 DDR3, DQL7 DDR3, DQSL DDR3_N, DQSL DDR3_P, DQSU DDR3_N, DQSU DDR3_P, DQU0 DDR3, DQU1 DDR3, DQU2 DDR3, DQU3 DDR3, DQU4 DDR3, DQU5 DDR3, DQU6 DDR3, DQU7 DDR3, nCAS DDR3, nCS DDR3, nRAS DDR3, nRST DDR3, nWE DDR3, ODT DDR3
net class JTAG Zynq: TCK Zynq, TDI Zynq, TDO Zynq, TMS Zynq

### Notes on the sheet
- (in symbol XNLX-XC7Z010-CLG225, part A) BANK 34
- (in symbol XNLX-XC7Z010-CLG225, part B) BANK 35

### Library data of the parts
C1 C3 C5-C9 C12-C14 C17 C19 C20 C24 C26-C28 C32-C34 = Capacitor 470nF: ComponentLink1Description: Datasheet link; ComponentLink1URL: http://www.yageo.com/documents/recent/UPY-GP_NP0_16V-to-50V_16.pdf
C2 C4 C10 C15 C16 C18 C23 C25 C31 C35 = Capacitor 4.7uF 4V: ComponentLink1Description: Datasheet link; ComponentLink1URL: http://www.yageo.com/documents/recent/UPY-GP_NP0_16V-to-50V_16.pdf
C11 C21 C22 C29 C30 = Capacitor 47uF: ComponentLink1Description: Datasheet link; ComponentLink1URL: http://www.yageo.com/documents/recent/UPY-GP_NP0_16V-to-50V_16.pdf
L1-L4 = BKP0603HS121-T: Inductor, Multilayer, Ferrite bad; PartNumber: LQG15HS3N9S02D; Manufacturer: MuRata; Value: 3.9nH; Imax_A: 750mA; Irms: 0.75A @ 25C rise; DCR_ohm: 0.14; Value1: 0.14 ohm; Value2: 0.75A; Material: Air Core; Green_Lifecycle: Active; SizeAreaWB_mm2: 3; Green_REACh: Passed; SizeZ_mm: 0.55; SizeX_mm: 1; SizeY_mm: 0.5; AEC Qualified: N; AEC Category: Q200; CompType: Inductor; PackageReference: 0402 polarized; Ind_H: 3.9nH; Technology: Multilayer; MountType: SMT; ComponentLink1Description: Datasheet link; ComponentLink1URL: https://search.murata.co.jp/Ceramy/image/img/P02/JELF243B-0010.pdf; RoHS: Y; Supplier 1: Digi-Key; Supplier Part Number 1: 490-2617-1-ND; Supplier 2: Mouser; Supplier Part Number 2: 81-LQG15HS3N9S02D; Green_EU RoHS-2: Incomplete; Green_EU RoHS: Passed; SizeArea_mm2: 0.5; AEC Grade: N/A; Value: BKP0603HS121-T
R1 = Resistor 2.61K
R2 R3 = Resistor 12.1K
R4 R5 = Resistor 80.6R
R6 R7 = Resistor 4.7K
R8 = Resistor 33R
R9-R11 = Resistor 1.43K
Shield1 = SMS-252: EMI shield Leader tech SMS-252; Manufacturer 1: Ethertronics; Manufacturer Part Number 1: M830520; ComponentLink1Description: Datasheet URL; ComponentLink1URL: http://www.ethertronics.com/files/6014/0708/4228/Savvi_WLAN__8x3_M830510.pdf; Supplier 1: Digi-Key; Stock 1: 10391; Pricing 1: 1=2,09000, 10=1,87400, 25=1,76800, 100=1,50630, 250=1,41440, 500=1,23760 (USD); RoHS: No; ComponentLink2URL: https://media.digikey.com/pdf/Data%20Sheets/Ethertronics/M830520.pdf?src-supplier=Digi-Key; ComponentLink2Description: https://media.digikey.com/pdf/Data%20Sheets/Ethertronics/M830520.pdf?src-supplier=Digi-Key; Supplier Part Number 1: 939-1070-1-ND
TP1 TP2 TP71 TP72 = Test point: Test Point, Miniature, SMT; ComponentLink1Description: Datasheet URL; ComponentLink1URL: http://www.keyelco.com/userAssets/store/files/5015.PDF
U1 = XNLX-XC7Z010-CLG225: IC SOC CORTEX-A9 ARTIX-7 225BGA; Manufacturer 1: Xilinx; Manufacturer Part Number 1: XC7Z010-1CLG400I; Speed Grade: -1; Interface: I2C,SPI,USB,CAN,Ethernet,MMC,SDIO,SD,UART,USART,EBI/EMI; Frequency: 667MHz; Number of I/Os: 130; Data Bus Width: 32b; Peripherals: DMA; Core Architecture: ARM; Operating Supply Voltage: 1V; Supplier 1: Digi-Key; Stock 1: 241; Pricing 1: 1=72,17000 (USD); RoHS: Yes; Case/Package: BGA; Number of Pins: 400; Contact Plating: Copper,Tin,Silver; Min Operating Temperature: -40°C; Max Operating Temperature: 100°C; Packaging: Tray; Max Frequency: 667MHz; Radiation Hardening: No; ComponentLink1URL: https://datasheet.ciiva.com/48476/ds190-zynq-7000-overview-48476886.pdf?src-supplier=Avnet; ComponentLink1Description: https://datasheet.ciiva.com/48476/ds190-zynq-7000-overview-48476886.pdf?src-supplier=Avnet; ComponentLink2URL: https://datasheet.ciiva.com/14849/ds187-xc7z010-xc7z020-data-sheet-14849932.pdf?src-supplier=Digi-Key; ComponentLink2Description: https://datasheet.ciiva.com/14849/ds187-xc7z010-xc7z020-data-sheet-14849932.pdf?src-supplier=Digi-Key; ComponentLink3Description: https://datasheet.ciiva.com/48476/ds190-zynq-7000-overview-48476887.pdf?src-supplier=Avnet; ComponentLink3URL: https://datasheet.ciiva.com/48476/ds190-zynq-7000-overview-48476887.pdf?src-supplier=Avnet; Manufacturer 2: Xilinx; Manufacturer Part Number 2: XC7Z010-1CLG400I; Package Quantity: 90; Pricing 2: 1=72,16000, 10=72,16000, 50=72,16000, 100=72,16000, 1000=72,16000, 10000=72,16000 (USD); Stock 2: 180; Supplier 2: Mouser; Supplier Part Number 2: 217-XC7Z010-1CLG400I
U2 = PCA9546ARGYR: PCA9546 Series 4-Channel I2C-Bus Switch w/ Interrupt Logic and Rst; Manufacturer 1: Texas Instruments; Bandwidth: 400kHz; Interface: I2C,SMBus; Logic Function: Multiplexer; Max Power Dissipation: 400mW; Max Supply Voltage: 5.5V; Min Supply Voltage: 2.3V; Number of Channels: 4; Number of Outputs: 1; On-State Resistance: 45R; Operating Supply Current: 3uA; Propagation Delay: 1ns; Throw Configuration: 4PST; Case/Package: VQFN; ComponentLink1Description: https://datasheet.ciiva.com/1784/pca9546a-1784314.pdf?src-supplier=Digi-Key; ComponentLink1URL: https://datasheet.ciiva.com/1784/pca9546a-1784314.pdf?src-supplier=Digi-Key; ComponentLink2Description: https://datasheet.ciiva.com/1784/pca9546a-1784315.pdf?src-supplier=Digi-Key; ComponentLink2URL: https://datasheet.ciiva.com/1784/pca9546a-1784315.pdf?src-supplier=Digi-Key; ComponentLink3Description: https://datasheet.ciiva.com/1784/pca9546a-1784316.pdf?src-supplier=Digi-Key; ComponentLink3URL: https://datasheet.ciiva.com/1784/pca9546a-1784316.pdf?src-supplier=Digi-Key; Lead Free: Lead Free; Manufacturer 2: Texas Instruments; Manufacturer Part Number 1: PCA9546ARGYR; Manufacturer Part Number 2: PCA9546ARGYR; Max Frequency: 400kHz; Max Operating Temperature: 85°C; Min Operating Temperature: -40°C; Mount: Surface Mount; Number of Inputs: 4; Number of Pins: 16; Package Quantity: 1; Packaging: Tape and Reel; Power Dissipation: 400mW; Pricing 1: 1=1,95000, 10=1,75200, 100=1,40850, 500=1,15720, 1000=0,95883 (USD); Pricing 2: 1=1,89000, 10=1,61000, 50=1,61000, 100=1,29000, 500=1,13000, 1000=0,93100, 3000=0,86700, 6000=0,83500, 9000=0,80300, 10000=0,80300 (USD); Radiation Hardening: No; RoHS: Yes; Stock 1: 2313; Stock 2: 3494; Supplier 1: Digi-Key; Supplier 2: Mouser; Supplier Part Number 1: 296-20969-1-ND; Supplier Part Number 2: 595-PCA9546ARGYR; Weight: 0.001312oz
Y1 = SIT8008AI-73-33E-33.333333G: Mems Osc, 33.333333MHZ, 2X1.6MM, Lvcmos; Manufacturer 1: SiTime; Value: *; ComponentLink1Description: https://media.digikey.com/pdf/Data%20Sheets/SiTime%20PDFs/New_Rev_FAQ.pdf?src-supplier=Digi-Key; ComponentLink1URL: https://media.digikey.com/pdf/Data%20Sheets/SiTime%20PDFs/New_Rev_FAQ.pdf?src-supplier=Digi-Key; Manufacturer 2: SiTime; Manufacturer Part Number 1: SIT8008AI-73-33E-33.333333G; Manufacturer Part Number 2: SIT8008AI-73-33E-33.333333G; Pricing 1: 1=1,25000, 10=1,10800 (USD); Pricing 2: 1=1,17000, 10=0,97200, 50=0,97200, 100=0,86000, 250=0,81700, 500=0,73100, 1000=0,64500, 2500=0,62300, 5000=0,60200, 10000=0,58100 (USD); RoHS: No; Stock 1: 47; Stock 2: 145; Supplier 1: Digi-Key; Supplier 2: Mouser; Supplier Part Number 1: 1473-30543-1-ND; Supplier Part Number 2: 788-8008AI733E-33.3G

## Sheet NNLightSwitcher_DDR3.SchDoc
size A4 portrait
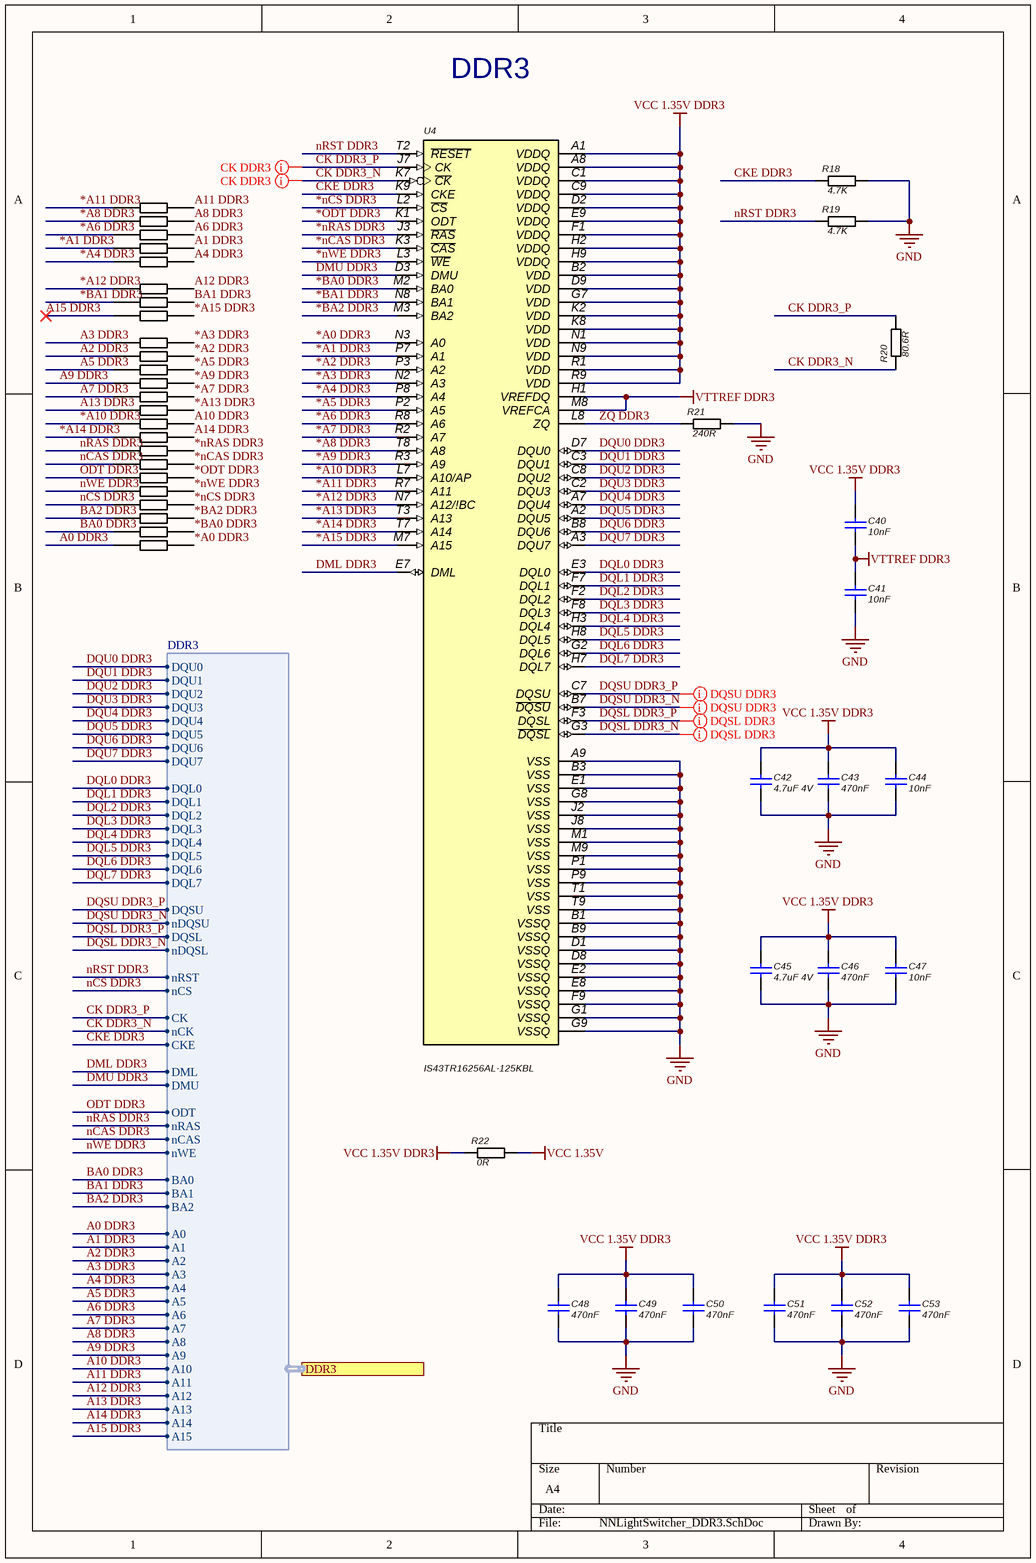
[diagram p3: NNLightSwitcher_DDR3.SchDoc]

### Parts
C40  10nF  [0402]
C41  10nF  [0402]
C42  4.7uF 4V  [0402]
C43  470nF  [0402]
C44  10nF  [0402]
C45  4.7uF 4V  [0402]
C46  470nF  [0402]
C47  10nF  [0402]
C48  470nF  [0402]
C49  470nF  [0402]
C50  470nF  [0402]
C51  470nF  [0402]
C52  470nF  [0402]
C53  470nF  [0402]
R18  4.7K  [0402]
R19  4.7K  [0402]
R20  80.6R  [0402]
R21  240R  [0402]
R22  0R  [0402]
RN1  EXB-2HV431JV  [*RESCAXE50P380X160X55-16N]  (value not drawn)  (parts A,B,C,D,E,F,G,H of 8)
RN2  EXB-2HV431JV  [*RESCAXE50P380X160X55-16N]  (value not drawn)  (parts A,B,C,D,E,F,G,H of 8)
RN3  EXB-2HV431JV  [*RESCAXE50P380X160X55-16N]  (value not drawn)  (parts A,B,C,D,E,F,G,H of 8)
U4  IS43TR16256AL-125KBL  [*BGA96C80P9X16_900X1300X120_IS43TR16256AL-125KBL(Primary)]

### Ports
DDR3 (harness DDR3)

### Harnesses
DDR3: A12, A11, A14, A13, A10, A9, A15, A8, A7, A6, A5, A4, A3, A2, A1, A0, BA2, BA1, BA0, nWE, nCAS, nRAS, ODT, DMU, DML, CKE, nCK, CK, nCS, nRST, nDQSL, nDQSU, DQSL, DQSU, DQL7, DQL6, DQL5, DQL4, DQL3, DQL2, DQL1, DQL0, DQU7, DQU6, DQU5, DQU4, DQU3, DQU2, DQU1, DQU0

### Nets
GND: C41.2 C42.2 C43.2 C44.2 C45.2 C46.2 C47.2 C48.2 C49.2 C50.2 C51.2 C52.2 C53.2 R18.2 R19.2 R21.2 U4.A9(VSS) U4.B1(VSSQ) U4.B3(VSS) U4.B9(VSSQ) U4.D1(VSSQ) U4.D8(VSSQ) U4.E1(VSS) U4.E2(VSSQ) U4.E8(VSSQ) U4.F9(VSSQ) U4.G1(VSSQ) U4.G8(VSS) U4.G9(VSSQ) U4.J2(VSS) U4.J8(VSS) U4.M1(VSS) U4.M9(VSS) U4.P1(VSS) U4.P9(VSS) U4.T1(VSS) U4.T9(VSS)
VCC 1.35V: R22.2
VCC 1.35V DDR3: C40.1 C42.1 C43.1 C44.1 C45.1 C46.1 C47.1 C48.1 C49.1 C50.1 C51.1 C52.1 C53.1 R22.1 U4.A1(VDDQ) U4.A8(VDDQ) U4.B2(VDD) U4.C1(VDDQ) U4.C9(VDDQ) U4.D2(VDDQ) U4.D9(VDD) U4.E9(VDDQ) U4.F1(VDDQ) U4.G7(VDD) U4.H2(VDDQ) U4.H9(VDDQ) U4.K2(VDD) U4.K8(VDD) U4.N1(VDD) U4.N9(VDD) U4.R1(VDD) U4.R9(VDD)
VTTREF DDR3: C40.2 C41.1 U4.H1(VREFDQ) U4.M8(VREFCA)
*A0 DDR3: RN3.9 U4.N3(A0)
*A1 DDR3: RN1.4 U4.P7(A1)
*A2 DDR3: RN2.15 U4.P3(A2)
*A3 DDR3: RN2.16 U4.N2(A3)
*A4 DDR3: RN1.5 U4.P8(A4)
*A5 DDR3: RN2.14 U4.P2(A5)
*A6 DDR3: RN1.3 U4.R8(A6)
*A7 DDR3: RN2.12 U4.R2(A7)
*A8 DDR3: RN1.2 U4.T8(A8)
*A9 DDR3: RN2.13 U4.R3(A9)
*A10 DDR3: RN2.7 U4.L7(A10/AP)
*A11 DDR3: RN1.1 U4.R7(A11)
*A12 DDR3: RN1.6 U4.N7(A12/!BC)
*A13 DDR3: RN2.11 U4.T3(A13)
*A14 DDR3: RN2.8 U4.T7(A14)
*A15 DDR3: RN1.8 U4.M7(A15)
*BA0 DDR3: RN3.10 U4.M2(BA0)
*BA1 DDR3: RN1.7 U4.N8(BA1)
*BA2 DDR3: RN3.11 U4.M3(BA2)
*nCAS DDR3: RN3.15 U4.K3(~{CAS})
*nCS DDR3: RN3.12 U4.L2(~{CS})
*nRAS DDR3: RN3.16 U4.J3(~{RAS})
*nWE DDR3: RN3.13 U4.L3(~{WE})
*ODT DDR3: RN3.14 U4.K1(ODT)
A0 DDR3: RN3.8 ; port DDR3.A0
A1 DDR3: RN1.13 ; port DDR3.A1
A2 DDR3: RN2.2 ; port DDR3.A2
A3 DDR3: RN2.1 ; port DDR3.A3
A4 DDR3: RN1.12 ; port DDR3.A4
A5 DDR3: RN2.3 ; port DDR3.A5
A6 DDR3: RN1.14 ; port DDR3.A6
A7 DDR3: RN2.5 ; port DDR3.A7
A8 DDR3: RN1.15 ; port DDR3.A8
A9 DDR3: RN2.4 ; port DDR3.A9
A10 DDR3: RN2.10 ; port DDR3.A10
A11 DDR3: RN1.16 ; port DDR3.A11
A12 DDR3: RN1.11 ; port DDR3.A12
A13 DDR3: RN2.6 ; port DDR3.A13
A14 DDR3: RN2.9 ; port DDR3.A14
A15 DDR3: RN1.9 ; port DDR3.A15
BA0 DDR3: RN3.7 ; port DDR3.BA0
BA1 DDR3: RN1.10 ; port DDR3.BA1
BA2 DDR3: RN3.6 ; port DDR3.BA2
CK DDR3_N: R20.1 U4.K7(~{CK}) ; port DDR3.nCK
CK DDR3_P: R20.2 U4.J7(CK) ; port DDR3.CK
CKE DDR3: R18.1 U4.K9(CKE) ; port DDR3.CKE
DML DDR3: U4.E7(DML) ; port DDR3.DML
DMU DDR3: U4.D3(DMU) ; port DDR3.DMU
DQL0 DDR3: U4.E3(DQL0) ; port DDR3.DQL0
DQL1 DDR3: U4.F7(DQL1) ; port DDR3.DQL1
DQL2 DDR3: U4.F2(DQL2) ; port DDR3.DQL2
DQL3 DDR3: U4.F8(DQL3) ; port DDR3.DQL3
DQL4 DDR3: U4.H3(DQL4) ; port DDR3.DQL4
DQL5 DDR3: U4.H8(DQL5) ; port DDR3.DQL5
DQL6 DDR3: U4.G2(DQL6) ; port DDR3.DQL6
DQL7 DDR3: U4.H7(DQL7) ; port DDR3.DQL7
DQSL DDR3_N: U4.G3(~{DQSL}) ; port DDR3.nDQSL
DQSL DDR3_P: U4.F3(DQSL) ; port DDR3.DQSL
DQSU DDR3_N: U4.B7(~{DQSU}) ; port DDR3.nDQSU
DQSU DDR3_P: U4.C7(DQSU) ; port DDR3.DQSU
DQU0 DDR3: U4.D7(DQU0) ; port DDR3.DQU0
DQU1 DDR3: U4.C3(DQU1) ; port DDR3.DQU1
DQU2 DDR3: U4.C8(DQU2) ; port DDR3.DQU2
DQU3 DDR3: U4.C2(DQU3) ; port DDR3.DQU3
DQU4 DDR3: U4.A7(DQU4) ; port DDR3.DQU4
DQU5 DDR3: U4.A2(DQU5) ; port DDR3.DQU5
DQU6 DDR3: U4.B8(DQU6) ; port DDR3.DQU6
DQU7 DDR3: U4.A3(DQU7) ; port DDR3.DQU7
nCAS DDR3: RN3.2 ; port DDR3.nCAS
nCS DDR3: RN3.5 ; port DDR3.nCS
nRAS DDR3: RN3.1 ; port DDR3.nRAS
nRST DDR3: R19.1 U4.T2(~{RESET}) ; port DDR3.nRST
nWE DDR3: RN3.4 ; port DDR3.nWE
ODT DDR3: RN3.3 ; port DDR3.ODT
ZQ DDR3: R21.1 U4.L8(ZQ)

### Layout directives
differential pair: CK DDR3_N, CK DDR3_P, DQSL DDR3_N, DQSL DDR3_P, DQSU DDR3_N, DQSU DDR3_P

### Notes on the sheet
- DDR3

### Library data of the parts
C40 C41 C44 C47 = Capacitor 10nF: ComponentLink1Description: Datasheet link; ComponentLink1URL: http://www.yageo.com/documents/recent/UPY-GP_NP0_16V-to-50V_16.pdf
C42 C45 = Capacitor 4.7uF 4V: ComponentLink1Description: Datasheet link; ComponentLink1URL: http://www.yageo.com/documents/recent/UPY-GP_NP0_16V-to-50V_16.pdf
C43 C46 C48-C53 = Capacitor 470nF: ComponentLink1Description: Datasheet link; ComponentLink1URL: http://www.yageo.com/documents/recent/UPY-GP_NP0_16V-to-50V_16.pdf
R18 R19 = Resistor 4.7K
R20 = Resistor 80.6R
R21 = Resistor 240R
R22 = Resistor 0R
RN1-RN3 = EXB-2HV431JV: Res Thick Film Array; Value: 33 R
U4 = IS43TR16256AL-125KBL: 4G, 1.35V, DDR3L, 256Mx16, 1600MT/s @ 11-11-11, 96 ball BGA _9mm x13mm_ RoHS; Manufacturer 1: ISSI; Access Time: 255ps; Data Bus Width: 16b; Frequency: 800MHz; Interface: Parallel; Max Supply Voltage: 1.45V; Memory Size: 4Gb; Memory Type: RAM,DDR3 SDRAM; Min Supply Voltage: 1.283V; Value: *; Case/Package: TFBGA; ComponentLink1Description: https://datasheet.ciiva.com/18617/43-46tr16256a-85120al-18617927.pdf?src-supplier=Digi-Key; ComponentLink1URL: https://datasheet.ciiva.com/18617/43-46tr16256a-85120al-18617927.pdf?src-supplier=Digi-Key; Manufacturer 2: ISSI; Manufacturer Part Number 1: IS43TR16256AL-125KBL; Manufacturer Part Number 2: IS43TR16256AL-125KBL; Max Frequency: 800MHz; Max Operating Temperature: 70°C; Min Operating Temperature: 0°C; Number of Pins: 96; Package Quantity: 190; Packaging: Tray; Pricing 1: 1=8,90000, 10=8,18800, 25=8,01840, 50=7,99000, 190=7,16784, 380=6,95047, 570=6,61028, 1140=6,37875 (USD); Pricing 2: 1=8,90000, 10=8,19000, 25=8,00000, 50=8,00000, 100=7,17000, 250=6,96000, 500=6,61000, 1000=6,61000, 10000=6,61000 (USD); RoHS: Yes; Stock 1: 6597; Stock 2: 3561; Supplier 1: Digi-Key; Supplier 2: Mouser; Supplier Part Number 1: 706-1207-ND; Supplier Part Number 2: 870-43T16256AL125KBL

## Sheet NNLightSwitcher_eMMC_SD.SchDoc
size A4
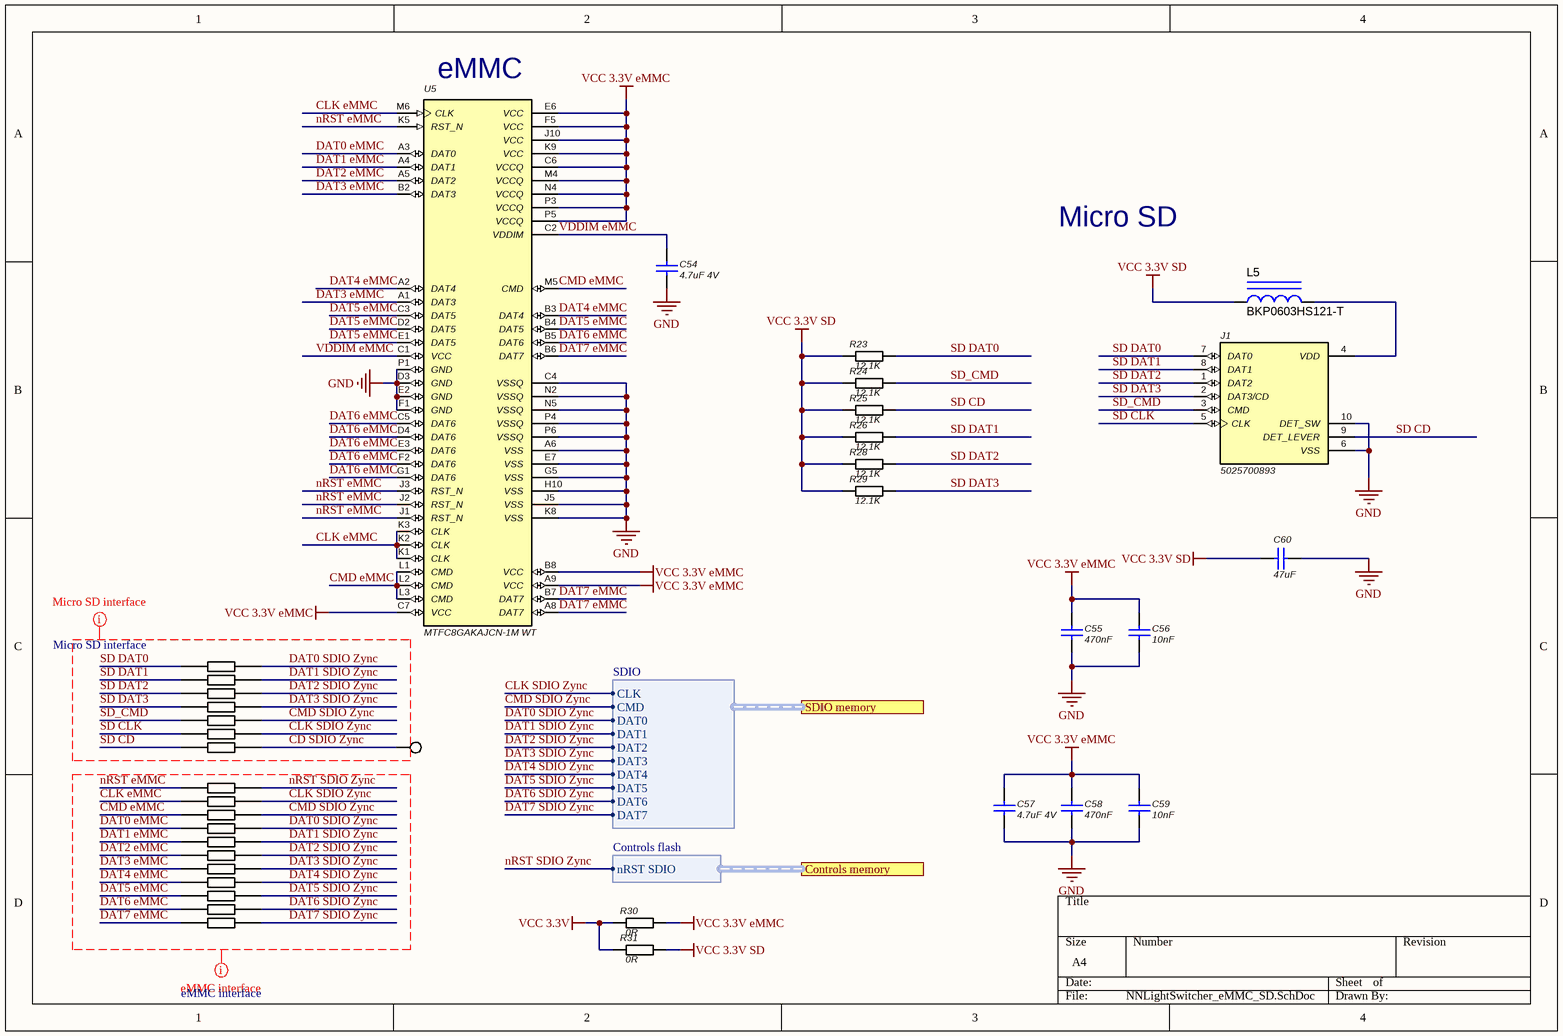
[diagram p4: NNLightSwitcher_eMMC_SD.SchDoc]

### Parts
C54  4.7uF 4V  [0402]
C55  470nF  [0402]
C56  10nF  [0402]
C57  4.7uF 4V  [0402]
C58  470nF  [0402]
C59  10nF  [0402]
C60  47uF  [Res_0805]
J1  5025700893  [MOLEX_5025700893]
L5  BKP0603HS121-T  [*0603]
R23  12.1K  [0402]
R24  12.1K  [0402]
R25  12.1K  [0402]
R26  12.1K  [0402]
R28  12.1K  [0402]
R29  12.1K  [0402]
R30  0R  [0402]
R31  0R  [0402]
RN25  EXB-2HV431JV  [*RESCAXE50P380X160X55-16N]  (value not drawn)  (parts A,B,C,D,E,F,G,H of 8)
RN26  EXB-2HV431JV  [*RESCAXE50P380X160X55-16N]  (value not drawn)  (parts A,B,C,D,E,F,G,H of 8)
RN27  EXB-2HV431JV  [*RESCAXE50P380X160X55-16N]  (value not drawn)  (parts G,H of 8)
TP66  Test point  [Testpoint_with_pad]  (value not drawn)
U5  MTFC8GAKAJCN-1M WT  [*BGA153N50P14X14_1150X1300X100_MTFC4GACAAAM-1M_WT(Primary)]

### Ports
Controls memory (harness Controls flash), SDIO memory (harness SDIO)

### Harnesses
SDIO: CLK, CMD, DAT1, DAT0, DAT3, DAT2, DAT5, DAT4, DAT7, DAT6
Controls flash: nRST SDIO

### Nets
GND: C54.2 C55.2 C56.2 C57.2 C58.2 C59.2 C60.1 J1.6(VSS) J1.10(DET_SW) U5.A6(VSS) U5.C4(VSSQ) U5.D3(GND) U5.E2(GND) U5.E7(VSS) U5.F1(GND) U5.G5(VSS) U5.H10(VSS) U5.J5(VSS) U5.K8(VSS) U5.N2(VSSQ) U5.N5(VSSQ) U5.P1(GND) U5.P4(VSSQ) U5.P6(VSSQ)
VCC 3.3V: R30.1 R31.1
VCC 3.3V eMMC: C55.1 C56.1 C57.1 C58.1 C59.1 R30.2 U5.A9(VCC) U5.B8(VCC) U5.C6(VCCQ) U5.C7(VCC) U5.E6(VCC) U5.F5(VCC) U5.J10(VCC) U5.K9(VCC) U5.M4(VCCQ) U5.N4(VCCQ) U5.P3(VCCQ) U5.P5(VCCQ)
VCC 3.3V SD: C60.2 L5.1 R23.1 R24.1 R25.1 R26.1 R28.1 R29.1 R31.2
CD SDIO Zync: RN25.15 TP66.1
CLK eMMC: RN26.3 U5.K1(CLK) U5.K2(CLK) U5.K3(CLK) U5.M6(CLK)
CLK SDIO Zync: RN25.11 RN26.14 ; port SDIO memory.CLK
CMD eMMC: RN26.6 U5.L1(CMD) U5.L2(CMD) U5.L3(CMD) U5.M5(CMD)
CMD SDIO Zync: RN25.14 RN26.11 ; port SDIO memory.CMD
DAT0 eMMC: RN26.1 U5.A3(DAT0)
DAT0 SDIO Zync: RN25.9 RN26.16 ; port SDIO memory.DAT0
DAT1 eMMC: RN26.2 U5.A4(DAT1)
DAT1 SDIO Zync: RN25.10 RN26.15 ; port SDIO memory.DAT1
DAT2 eMMC: RN26.4 U5.A5(DAT2)
DAT2 SDIO Zync: RN25.12 RN26.13 ; port SDIO memory.DAT2
DAT3 eMMC: RN26.5 U5.A1(DAT3) U5.B2(DAT3)
DAT3 SDIO Zync: RN25.13 RN26.12 ; port SDIO memory.DAT3
DAT4 eMMC: RN26.7 U5.A2(DAT4) U5.B3(DAT4)
DAT4 SDIO Zync: RN26.10 ; port SDIO memory.DAT4
DAT5 eMMC: RN26.8 U5.B4(DAT5) U5.C3(DAT5) U5.D2(DAT5) U5.E1(DAT5)
DAT5 SDIO Zync: RN26.9 ; port SDIO memory.DAT5
DAT6 eMMC: RN27.8 U5.B5(DAT6) U5.C5(DAT6) U5.D4(DAT6) U5.E3(DAT6) U5.F2(DAT6) U5.G1(DAT6)
DAT6 SDIO Zync: RN27.9 ; port SDIO memory.DAT6
DAT7 eMMC: RN27.7 U5.A8(DAT7) U5.B6(DAT7) U5.B7(DAT7)
DAT7 SDIO Zync: RN27.10 ; port SDIO memory.DAT7
nRST eMMC: RN25.1 U5.J1(RST_N) U5.J2(RST_N) U5.J3(RST_N) U5.K5(RST_N)
nRST SDIO Zync: RN25.16 ; port Controls memory.nRST SDIO  [project net nMRST]
SD CD: J1.9(DET_LEVER) R25.2 RN25.2
SD CLK: J1.5(CLK) RN25.6
SD DAT0: J1.7(DAT0) R23.2 RN25.8
SD DAT1: J1.8(DAT1) R26.2 RN25.7
SD DAT2: J1.1(DAT2) R28.2 RN25.5
SD DAT3: J1.2(DAT3/CD) R29.2 RN25.4
SD_CMD: J1.3(CMD) R24.2 RN25.3
VDDIM eMMC: C54.1 U5.C1(VCC) U5.C2(VDDIM)
NetJ1_4: J1.4(VDD) L5.2

### Layout directives
net class eMMC interface: CLK eMMC, CLK SDIO Zync, CMD eMMC, CMD SDIO Zync, DAT0 eMMC, DAT0 SDIO Zync, DAT1 eMMC, DAT1 SDIO Zync, DAT2 eMMC, DAT2 SDIO Zync, DAT3 eMMC, DAT3 SDIO Zync, DAT4 eMMC, DAT4 SDIO Zync, DAT5 eMMC, DAT5 SDIO Zync, DAT6 eMMC, DAT6 SDIO Zync, DAT7 eMMC, DAT7 SDIO Zync, nRST eMMC, nRST SDIO Zync
net class Micro SD interface: CD SDIO Zync, CLK SDIO Zync, CMD SDIO Zync, DAT0 SDIO Zync, DAT1 SDIO Zync, DAT2 SDIO Zync, DAT3 SDIO Zync, SD CD, SD CLK, SD DAT0, SD DAT1, SD DAT2, SD DAT3, SD_CMD

### Notes on the sheet
- (near U5) eMMC
- Micro SD

### Library data of the parts
C54 C57 = Capacitor 4.7uF 4V: ComponentLink1Description: Datasheet link; ComponentLink1URL: http://www.yageo.com/documents/recent/UPY-GP_NP0_16V-to-50V_16.pdf
C55 C58 = Capacitor 470nF: ComponentLink1Description: Datasheet link; ComponentLink1URL: http://www.yageo.com/documents/recent/UPY-GP_NP0_16V-to-50V_16.pdf
C56 C59 = Capacitor 10nF: ComponentLink1Description: Datasheet link; ComponentLink1URL: http://www.yageo.com/documents/recent/UPY-GP_NP0_16V-to-50V_16.pdf
C60 = Capacitor 47uF: ComponentLink1Description: Datasheet link; ComponentLink1URL: http://www.yageo.com/documents/recent/UPY-GP_NP0_16V-to-50V_16.pdf
J1 = Micro SD connector: 1.10mm Pitch microSD Memory Card Connector%2C Normal Mount Surface Mount%2C Push-Push Type; Manufacturer 1: Molex; Current Rating: 500mA; Voltage Rating (AC): 10V; Max Voltage Rating (DC): 1.01kV; Gender: Female; Number of Contacts: 8; Pitch: 1.1mm; Value: 5025700893; Supplier 1: Digi-Key; Manufacturer Part Number 1: 5025700893; Stock 1: 14343; Pricing 1: 1=3,97000, 10=3,81200, 25=3,49440, 50=3,33560, 100=3,17680, 250=2,77972, 500=2,70028 (USD); RoHS: Yes; Mount: Surface Mount,Standard; Contact Material: Copper Alloy,Copper; Contact Plating: Gold; Housing Material: Polymer; Min Operating Temperature: -25°C; Max Operating Temperature: 85°C; Packaging: Tape and Reel; Number of Rows: 1; Package Quantity: 1; Connector Type: Connector; Termination: SMD/SMT; Orientation: Right Angle; Number of Circuits: 8; Length: 13.8mm; Height: 1.8mm; Width: 1.8mm; Depth: 15.5mm; Radiation Hardening: No; REACH SVHC: Unknown; Halogen Free: Low Halogen; Lead Free: Lead Free; ComponentLink1URL: https://datasheet.ciiva.com/684/5025700893-sd-684306.pdf?src-supplier=Digi-Key; ComponentLink1Description: https://datasheet.ciiva.com/684/5025700893-sd-684306.pdf?src-supplier=Digi-Key; ComponentLink2URL: https://datasheet.ciiva.com/4581/5025700893-memory-card-socket-179363-4581107.pdf?src-supplier=Mouser; ComponentLink2Description: https://datasheet.ciiva.com/4581/5025700893-memory-card-socket-179363-4581107.pdf?src-supplier=Mouser; ComponentLink3URL: https://datasheet.ciiva.com/16547/5025700893-memory-card-socket-16547219.pdf?src-supplier=Avnet+Europe; ComponentLink3Description: https://datasheet.ciiva.com/16547/5025700893-memory-card-socket-16547219.pdf?src-supplier=Avnet+Europe; ComponentLink4URL: https://datasheet.ciiva.com/1105/1630840-1105304.pdf?src-supplier=Element14; ComponentLink4Description: https://datasheet.ciiva.com/1105/1630840-1105304.pdf?src-supplier=Element14; ComponentLink5URL: https://datasheet.ciiva.com/11755/0900766b80f7529e-11755048.pdf?src-supplier=RSComponents; ComponentLink5Description: https://datasheet.ciiva.com/11755/0900766b80f7529e-11755048.pdf?src-supplier=RSComponents; ComponentLink6URL: https://datasheet.ciiva.com/15174/getdatasheetpartid-321553-15174794.pdf?src-supplier=Verical; ComponentLink6Description: https://datasheet.ciiva.com/15174/getdatasheetpartid-321553-15174794.pdf?src-supplier=Verical; ComponentLink7URL: https://datasheet.ciiva.com/1104/ps-502570-001-1104669.pdf?src-supplier=Element14; ComponentLink7Description: https://datasheet.ciiva.com/1104/ps-502570-001-1104669.pdf?src-supplier=Element14; ComponentLink8URL: https://datasheet.ciiva.com/684/5025700893-sd-684307.pdf?src-supplier=Digi-Key; ComponentLink8Description: https://datasheet.ciiva.com/684/5025700893-sd-684307.pdf?src-supplier=Digi-Key; ComponentLink9URL: https://datasheet.ciiva.com/684/5025700893-sd-684308.pdf?src-supplier=Digi-Key; ComponentLink9Description: https://datasheet.ciiva.com/684/5025700893-sd-684308.pdf?src-supplier=Digi-Key; ComponentLink10URL: https://datasheet.ciiva.com/16469/5025700893-memory-card-socket-16469082.pdf?src-supplier=Avnet+Asia; ComponentLink10Description: https://datasheet.ciiva.com/16469/5025700893-memory-card-socket-16469082.pdf?src-supplier=Avnet+Asia; ComponentLink11URL: https://datasheet.ciiva.com/3121/5025700893-memory-card-socket-3121179.pdf?src-supplier=Avnet; ComponentLink11Description: https://datasheet.ciiva.com/3121/5025700893-memory-card-socket-3121179.pdf?src-supplier=Avnet; Supplier Part Number 1: WM19093CT-ND
L5 = BKP0603HS121-T: as L1 on sheet NNLightSwitcher_Zynq; CompType: Inductor; PackageReference: 0402 polarized; Ind_H: 3.9nH; Technology: Multilayer; MountType: SMT; ComponentLink1Description: Datasheet link; ComponentLink1URL: https://search.murata.co.jp/Ceramy/image/img/P02/JELF243B-0010.pdf; RoHS: Y; Supplier 1: Digi-Key; Supplier Part Number 1: 490-2617-1-ND; Supplier 2: Mouser; Supplier Part Number 2: 81-LQG15HS3N9S02D; Green_EU RoHS-2: Incomplete; Green_EU RoHS: Passed; SizeArea_mm2: 0.5; AEC Grade: N/A; Value: BKP0603HS121-T
R23-R26 R28 R29 = Resistor 12.1K
R30 R31 = Resistor 0R
RN25-RN27 = EXB-2HV431JV: Res Thick Film Array; Value: 33 R
TP66 = Test point: Test Point, Miniature, SMT; ComponentLink1Description: Datasheet URL; ComponentLink1URL: http://www.keyelco.com/userAssets/store/files/5015.PDF
U5 = MTFC4GACAAAM-1M_WT: J54A eMMC 32G ECCN: 3A991 / HTS: 8542.32.0070; Manufacturer 1: Micron Technology; Manufacturer Part Number 1: MTFC4GACAJCN-4MITTR; Pricing 1: 1=10,20000, 10=9,40000, 25=9,21000, 50=9,16000, 100=8,23000, 250=7,98000, 500=7,58000, 1000=6,66000, 2000=6,17000, 10000=6,66000 (USD); RoHS: No; Stock 1: 4219; Supplier 1: Mouser; Supplier Part Number 1: 340-294892-REEL

## Sheet NNLightSwitcher_QSPI_Flash.SchDoc
size A4
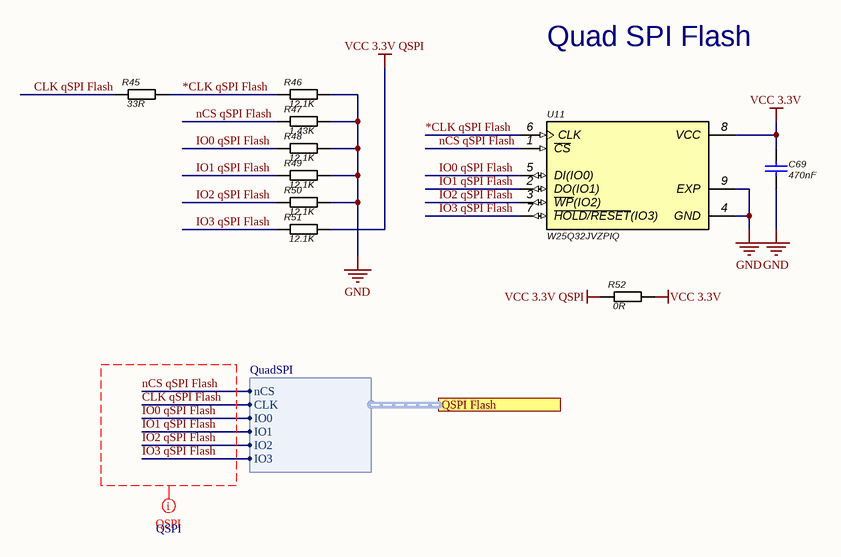
[diagram p5: NNLightSwitcher_QSPI_Flash.SchDoc]

### Parts
C69  470nF  [0402]
R45  33R  [0402]
R46  12.1K  [0402]
R47  1.43K  [0402]
R48  12.1K  [0402]
R49  12.1K  [0402]
R50  12.1K  [0402]
R51  12.1K  [0402]
R52  0R  [0402]
U11  W25Q32JVZPIQ  [*SON127P600X500X80-9N]

### Ports
QSPI Flash (harness QuadSPI)

### Harnesses
QuadSPI: IO1, IO0, IO3, IO2, CLK, nCS

### Nets
GND: C69.2 R46.2 R47.2 R48.2 R49.2 R50.2 U11.4(GND) U11.9(EXP)
VCC 3.3V: C69.1 R52.2 U11.8(VCC)
VCC 3.3V QSPI: R51.2 R52.1
*CLK qSPI Flash: R45.2 R46.1 U11.6(CLK)
CLK qSPI Flash: R45.1 ; port QSPI Flash.CLK
IO0 qSPI Flash: R48.1 U11.5(DI(IO0)) ; port QSPI Flash.IO0
IO1 qSPI Flash: R49.1 U11.2(DO(IO1)) ; port QSPI Flash.IO1
IO2 qSPI Flash: R50.1 U11.3(~{WP}(IO2)) ; port QSPI Flash.IO2
IO3 qSPI Flash: R51.1 U11.7(~{HOLD/RESET}(IO3)) ; port QSPI Flash.IO3
nCS qSPI Flash: R47.1 U11.1(~{CS}) ; port QSPI Flash.nCS

### Layout directives
net class QSPI: CLK qSPI Flash, IO0 qSPI Flash, IO1 qSPI Flash, IO2 qSPI Flash, IO3 qSPI Flash, nCS qSPI Flash

### Notes on the sheet
- Quad SPI Flash

### Library data of the parts
C69 = Capacitor 470nF: ComponentLink1Description: Datasheet link; ComponentLink1URL: http://www.yageo.com/documents/recent/UPY-GP_NP0_16V-to-50V_16.pdf
R45 = Resistor 33R
R46 R48-R51 = Resistor 12.1K
R47 = Resistor 1.43K
R52 = Resistor 0R
U11 = W25Q32JVZPIQ: Serial Flash Memory With Dual, Quad Spi; Manufacturer 1: Winbond; Value: *; ComponentLink1Description: http://www.winbond.com/resource-files/w25q32jv%20revg%2003272018%20plus.pdf?src-supplier=Digi-Key; ComponentLink1URL: http://www.winbond.com/resource-files/w25q32jv%20revg%2003272018%20plus.pdf?src-supplier=Digi-Key; Manufacturer Part Number 1: W25Q32JVZPIQ; Pricing 1: 1=0,79000, 10=0,71800, 25=0,70880, 50=0,70500, 100=0,63030, 300=0,62487, 500=0,61576, 1000=0,59355, 5000=0,54075 (USD); RoHS: No; Stock 1: 58629; Supplier 1: Digi-Key; Supplier Part Number 1: W25Q32JVZPIQ-ND